# Altium schematic sheet WB55_Schematic.SchDoc
size A4; SheetNumber: 1; SheetTotal: 5
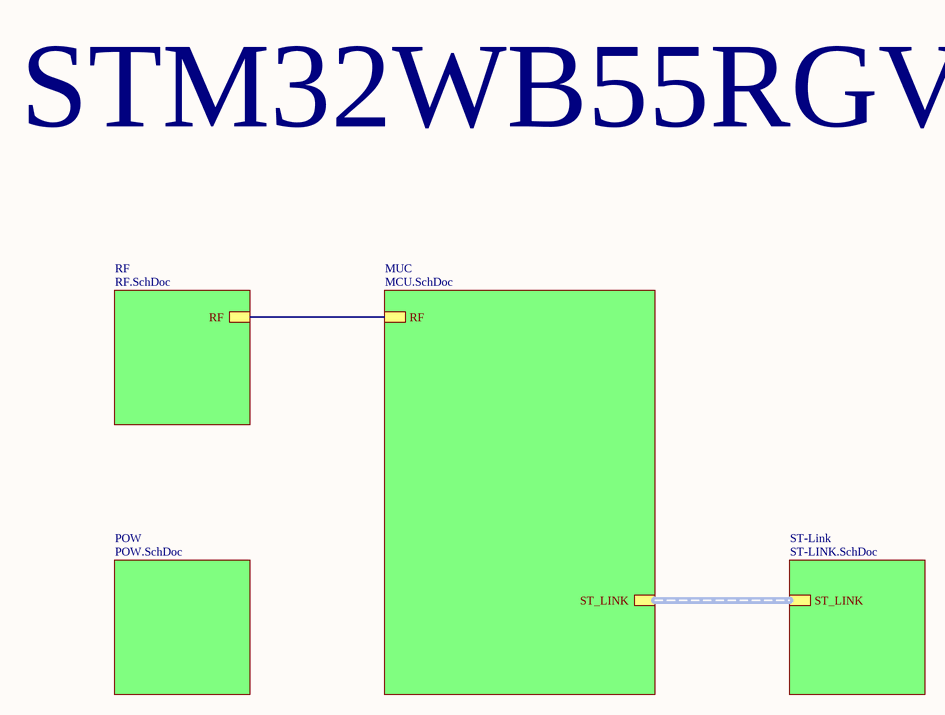
[diagram p0: WB55_Schematic.SchDoc]

## Sub-sheets
MUC = MCU.SchDoc: RF, ST_LINK
POW = POW.SchDoc: no entries
RF = RF.SchDoc: RF
ST-Link = ST-LINK.SchDoc: ST_LINK

## Nets
(unnamed): sheet MUC/RF, sheet RF/RF

## Buses and harness runs
harness sheet MUC/ST_LINK = sheet ST-Link/ST_LINK

## Notes on the sheet
- STM32WB55RGV6